# EasyEDA Pro project 运动目标控制与自动追踪系统_2023-08-13.epro

# Schematic Schematic1
Create Date: 2023-08-12; Page Name: 运动目标控制与自动追踪系统; Project Name: 运动目标控制与自动追踪系统; Schematic Name: Schematic1; Update Date: 2023-08-13; Company: 嘉立创EDA; Page Size: A4; Version: V1.0
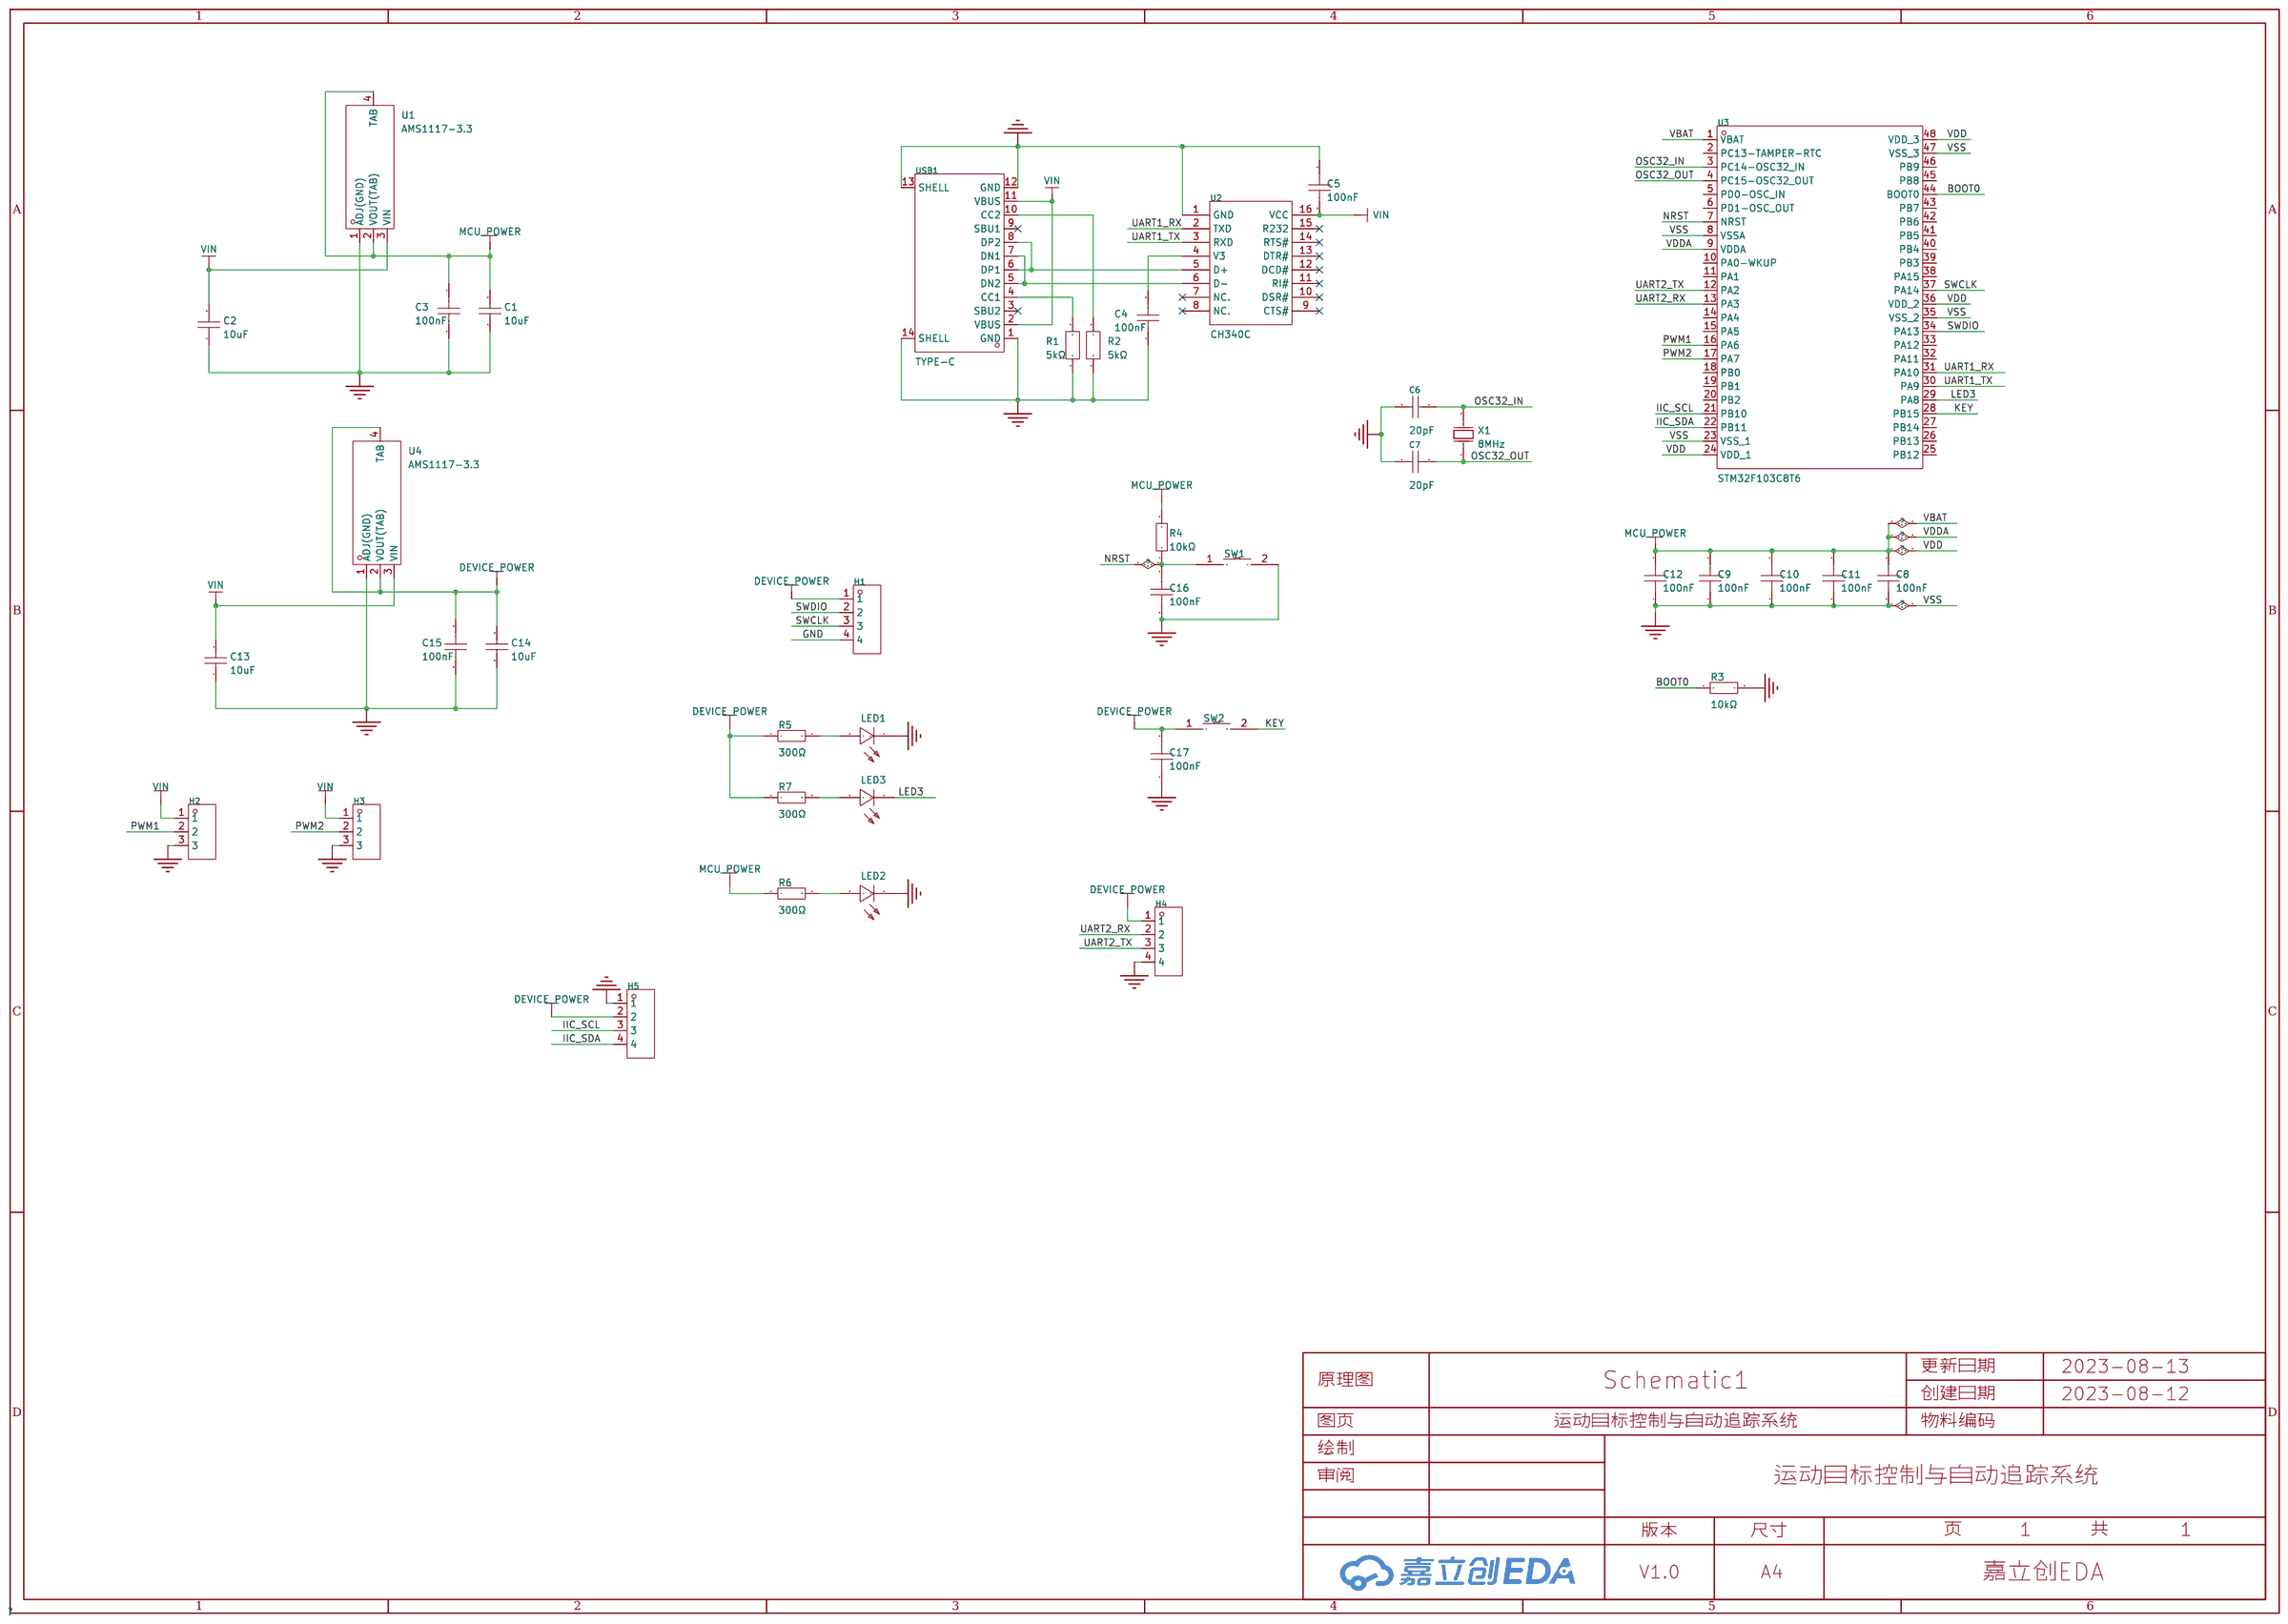
[diagram p0: schematic sheet]

## Parts
C1  10uF  [C0805]
C2  10uF  [C0805]
C3  100nF  [C0603]
C4  100nF  [C0603]
C5  100nF  [C0603]
C6  20pF  [C0402]
C7  20pF  [C0402]
C8  100nF  [C0603]
C9  100nF  [C0603]
C10  100nF  [C0603]
C11  100nF  [C0603]
C12  100nF  [C0603]
C13  10uF  [C0805]
C14  10uF  [C0805]
C15  100nF  [C0603]
C16  100nF  [C0603]
C17  100nF  [C0603]
H1  PZ254R-11-04P  [HDR-TH_4P-P2.54-H-M-W10.4]
H2  PZ254V-11-03P  [HDR-TH_3P-P2.54-V-M]
H3  PZ254V-11-03P  [HDR-TH_3P-P2.54-V-M]
H4  PZ254R-11-04P  [HDR-TH_4P-P2.54-H-M-W10.4]
H5  PM254V-11-04-H85  [HDR-TH_4P-P2.54-V-F]
LED1  NCD0603R1  [LED0603-RD_RED]
LED2  NCD0603R1  [LED0603-RD_RED]
LED3  NCD0603R1  [LED0603-RD_RED]
R1  5kΩ  [R0603]
R2  5kΩ  [R0603]
R3  10kΩ  [R0603]
R4  10kΩ  [R0603]
R5  300Ω  [R0603]
R6  300Ω  [R0603]
R7  300Ω  [R0603]
SW1  TS-1101-C-W  [SW-SMD_L6.0-W3.3-LS8.0]
SW2  TS-1101-C-W  [SW-SMD_L6.0-W3.3-LS8.0]
U1  AMS1117-3.3  [SOT-223-4_L6.5-W3.5-P2.30-LS7.0-BR]
U2  CH340C  [SOP-16_L10.0-W3.9-P1.27-LS6.0-BL]
U3  STM32F103C8T6  [LQFP-48_L7.0-W7.0-P0.50-LS9.0-BL]
U4  AMS1117-3.3  [SOT-223-4_L6.5-W3.5-P2.30-LS7.0-BR]
USB1  TYPE-C  [USB-C-SMD_TYPE-C-6PIN-2MD-073]
X1  8MHz  [OSC-SMD_L5.0-W3.2]

## Library data of the parts
C1 C2 C13 C14 = CL21A106KAYNNNE_C15850: 容值:10uF;精度:±10%;额定电压:25V;材质(温度系数):X5R;; LCSC Part Name: 10uF ±10% 25V; Supplier Part: C15850; Manufacturer: SAMSUNG(三星); Manufacturer Part: CL21A106KAYNNNE; Supplier Footprint: 0805; JLCPCB Part Class: 基础库; Datasheet: https://atta.szlcsc.com/upload/public/pdf/source/20160103/1457707679302.pdf; Supplier: LCSC; Tolerance: ±10%; Voltage Rated: 25V; Temperature Coefficient: X5R
C3-C5 C8-C12 C15-C17 = CL10B104KB8NNNC: 容值:100nF;精度:±10%;额定电压:50V;材质(温度系数):X7R;; LCSC Part Name: 100nF ±10% 50V; Supplier Part: C1591; Manufacturer: SAMSUNG(三星); Supplier Footprint: 0603; JLCPCB Part Class: Extended Part; Datasheet: https://atta.szlcsc.com/upload/public/pdf/source/20160103/1457707680512.pdf; Supplier: LCSC; Tolerance: ±10%; Voltage Rated: 50V; Temperature Coefficient: X7R
C6 C7 = 0402CG200J500NT: 容值:20pF;精度:±5%;额定电压:50V;材质(温度系数):C0G;; LCSC Part Name: 20pF ±5% 50V; Supplier Part: C1554; Manufacturer: FH(风华); Supplier Footprint: 0402; JLCPCB Part Class: 基础库; Datasheet: https://atta.szlcsc.com/upload/public/pdf/source/20200305/C486355_26A10D38EF8C2A5C37091D0039909270.pdf; Supplier: LCSC; Tolerance: ±5%; Voltage Rated: 50V; Temperature Coefficient: C0G
H1 H4 = PZ254R-11-04P: 间距:2.54mm;总PIN位数:4;排数:1;插针结构:1x4P;行距:-;安装类型:弯插;圆针/方针:方针;额定电流:-;额定电压:-;配合针长度:6mm;塑高:2.5mm;触头材质:黄铜;触头镀层:-;工作温度范围:-40℃~+105℃;颜色:黑色;; LCSC Part Name: 2.54mm 1x4P 弯插 方针; Supplier Part: C492412; Manufacturer: XFCN(兴飞); Supplier Footprint: 插件,P=2.54mm; JLCPCB Part Class: 扩展库; Supplier: LCSC; Pitch: 2.54mm; Number of Pins: 4; Number of Rows: 1; Pin Structure: 1x4P; Mounting Type: 弯插; Circluar Pins/Square Pins: 方针; Length of Mating Pin: 6mm; Insulation Height: 2.5mm; Contact Material: 黄铜; Operating Temperature Range: -40℃~+105℃; Color: 黑色
H2 H3 = PZ254V-11-03P: 排数:单排;总PIN位数:3;间距:2.54mm;插针结构:1x3P;行距:-;安装类型:直插;圆针/方针:方针;额定电流:3A;额定电压:250V;配合针长度:6mm;塑高:2.5mm;端接针长度:3mm;工作温度范围:-40℃~+105℃;颜色:黑色;; LCSC Part Name: 2.54mm 1x3P 直插 方针; Supplier Part: C2937625; Manufacturer: XFCN(兴飞); Supplier Footprint: 直插,P=2.54mm; JLCPCB Part Class: 扩展库; Datasheet: 2022-07-12/581362A/62b9d00620994b3696be7eb4af85ad72/双排排针和单排排针.pdf; Supplier: LCSC; Number of Rows: 单排; Number of Pins: 3; Pitch: 2.54mm; Pin Structure: 1x3P; Mounting Type: 直插; Circluar Pins/Square Pins: 方针; Current Rating (Max): 3A; Voltage Rating (Max): 250V; Length of Mating Pin: 6mm; Insulation Height: 2.5mm; Length of End Connection Pin: 3mm; Operating Temperature Range: -40℃~+105℃; Color: 黑色
H5 = PM254V-11-04-H85: 排数:单排;总孔位数:4;间距:2.54mm;插孔结构:1x4P;行距:-;安装类型:直插;塑高:-;触头材质:黄铜;触头镀层:-;; LCSC Part Name: 2.54mm 1x4P; Supplier Part: C541851; Manufacturer: XFCN(兴飞); Supplier Footprint: 直插,P=2.54mm; JLCPCB Part Class: 扩展库; Supplier: LCSC; Number of Rows: 单排; Number of Holes: 4; Pitch: 2.54mm; Holes Structure: 1x4P; Mounting Type: 直插; Contact Material: 黄铜
LED1-LED3 = NCD0603R1_C84263: 发光颜色:红灯;; LCSC Part Name: 红灯; Supplier Part: C84263; Manufacturer: 国星光电; Supplier Footprint: 0603; JLCPCB Part Class: Extended Part; Datasheet: https://atta.szlcsc.com/upload/public/pdf/source/20200820/C84263_DABC6A75E58F576973B407FDBA283D60.pdf; Supplier: LCSC; Emitted Color: 红灯
R1 R2 = AR03BTCX5001: 电阻类型:薄膜电阻;阻值:5kΩ;精度:±0.1%;功率:100mW;; LCSC Part Name: 5kΩ ±0.1% 100mW; Supplier Part: C2828621; Manufacturer: Viking(光颉); Supplier Footprint: 0603; JLCPCB Part Class: 扩展库; Datasheet: https://atta.szlcsc.com/upload/public/pdf/source/20211009/C2828621_7F88408CB1D09DFC08036051E0A6050B.pdf; Supplier: LCSC; Type: 薄膜电阻; Tolerance: ±0.1%; Power(Watts): 100mW; Temperature Coefficient: ±25ppm/℃; Overload Voltage (Max): 50V; Operating Temperature Range: -55℃~+155℃
R3 = RC0603JR-0710KL: 电阻类型:厚膜电阻;阻值:10kΩ;精度:±5%;功率:100mW;; LCSC Part Name: 10kΩ ±5% 100mW; Supplier Part: C99198; Manufacturer: YAGEO(国巨); Supplier Footprint: 0603; JLCPCB Part Class: 扩展库; Datasheet: https://atta.szlcsc.com/upload/public/pdf/source/20181223/C99198_917934A193F41F77D9F7D214A8C79116.pdf; Supplier: LCSC; Type: 厚膜电阻; Tolerance: ±5%; Power(Watts): 100mW; Temperature Coefficient: ±100ppm/℃; Overload Voltage (Max): 75V; Operating Temperature Range: -55℃~+155℃
R4 = RC0603JR-0710KL: 电阻类型:厚膜电阻;阻值:10kΩ;精度:±5%;功率:100mW;; LCSC Part Name: 10kΩ ±5% 100mW; Supplier Part: C99198; Manufacturer: YAGEO(国巨); Supplier Footprint: 0603; JLCPCB Part Class: Extended Part; Datasheet: https://atta.szlcsc.com/upload/public/pdf/source/20181223/C99198_917934A193F41F77D9F7D214A8C79116.pdf; Supplier: LCSC; Type: 厚膜电阻; Tolerance: ±5%; Power(Watts): 100mW; Temperature Coefficient: ±100ppm/℃; Overload Voltage (Max): 75V; Operating Temperature Range: -55℃~+155℃
R5-R7 = 0603WAF3000T5E: 电阻类型:厚膜电阻;阻值:300Ω;精度:±1%;功率:100mW;; LCSC Part Name: 300Ω ±1% 100mW; Supplier Part: C23025; Manufacturer: UNI-ROYAL(厚声); Supplier Footprint: 0603; JLCPCB Part Class: 基础库; Datasheet: https://atta.szlcsc.com/upload/public/pdf/source/20200306/C422600_1E6D84923E4A46A82E41ADD87F860B5C.pdf; Supplier: LCSC; Type: 厚膜电阻; Tolerance: ±1%; Power(Watts): 100mW; Temperature Coefficient: ±100ppm/℃; Overload Voltage (Max): 75V; Operating Temperature Range: -55℃~+155℃
SW1 = TS-1101-C-W: 触点电流:50mA;额定电压(AC):-;额定电压(DC):12V;额定功率:-;绝缘电阻:-;电路结构:单刀单掷;安装方式:立贴;带灯:无;作用力:260gf;机械寿命:5万次;带支架:否;; LCSC Part Name: 立贴 6*3.6*2.5mm 轻触开关 一型3*6*2.5有白ZD b拉伸白色带淡绿按键 卷装; Supplier Part: C318938; Manufacturer: XKB Connectivity(中国星坤); Supplier Footprint: SMD; JLCPCB Part Class: 扩展库; Datasheet: https://atta.szlcsc.com/upload/public/pdf/source/20200227/C318938_C2E53B1EEDE37D980A33616AC086DE53.pdf; Supplier: LCSC; Contact Current: 50mA; Voltage Rating (DC): 12V; Circuit: 单刀单掷; Mounting Style: 立贴; Actuator Style: 矩形按钮; Actuator/Cap Color: 白色带淡绿; With Lamp: 无; Operating Force: 260gf; Mechanical Life: 5万次; Operating Temperature: -30℃~+85℃; Switch Length: 6mm; Switch Width: 3.6mm; Switch Height: 2.5mm; Strike Gundam: 否
SW2 = TS-1101-C-W: 触点电流:50mA;额定电压(AC):-;额定电压(DC):12V;额定功率:-;绝缘电阻:-;电路结构:单刀单掷;安装方式:立贴;带灯:无;作用力:260gf;机械寿命:5万次;带支架:否;; LCSC Part Name: 立贴 6*3.6*2.5mm 轻触开关 一型3*6*2.5有白ZD b拉伸白色带淡绿按键 卷装; Supplier Part: C318938; Manufacturer: XKB Connectivity(中国星坤); Supplier Footprint: SMD; JLCPCB Part Class: Extended Part; Datasheet: https://atta.szlcsc.com/upload/public/pdf/source/20200227/C318938_C2E53B1EEDE37D980A33616AC086DE53.pdf; Supplier: LCSC; Contact Current: 50mA; Voltage Rating (DC): 12V; Circuit: 单刀单掷; Mounting Style: 立贴; Actuator Style: 矩形按钮; Actuator/Cap Color: 白色带淡绿; With Lamp: 无; Operating Force: 260gf; Mechanical Life: 5万次; Operating Temperature: -30℃~+85℃; Switch Length: 6mm; Switch Width: 3.6mm; Switch Height: 2.5mm; Strike Gundam: 否
U1 U4 = AMS1117-3.3 SOT-223: 输出类型:固定;输出极性:正;最大输入电压:18V;输出电压:3.3V;输出电流:1A;电源纹波抑制比(PSRR):60dB@(120Hz);; Supplier Part: C347222; Manufacturer: UMW(广东友台半导体); Supplier Footprint: SOT-223; JLCPCB Part Class: Extended Part; Datasheet: https://atta.szlcsc.com/upload/public/pdf/source/20211011/50CC665C22E3A66C08379A4A74BDA25C.pdf; Supplier: LCSC; Output Type: 固定; Output Polarity: 正; Number of Outputs: 1; Maximum Input Voltage: 18V; Output Voltage: 3.3V; Dropout Voltage: 1.3V@(1A); Output Current: 1A; Power Supply Rejection Ratio (PSRR): 60dB@(120Hz)
U2 = CH340C: 应用功能:收发器;接口协议:USB 2.0;数据速率:2Mbps;; LCSC Part Name: CH340C USB转串口芯片 CH340; Supplier Part: C84681; Manufacturer: WCH(南京沁恒); Supplier Footprint: SOP-16; JLCPCB Part Class: Extended Part; Datasheet: https://atta.szlcsc.com/upload/public/pdf/source/20200819/C84681_ADBED554CE321879DBD6B1D06488689C.pdf; Supplier: LCSC; Applications Function: 收发器; Protocol: USB 2.0; Data Rate: 2Mbps; Supply Voltage: 3.3V；5V
U3 = STM32F103C8T6: CPU内核:ARM Cortex-M3;CPU最大主频:72MHz;工作电压范围:2V~3.6V;内部振荡器:有;程序 FLASH容量:64K@x8bit;RAM总容量:20KB;EEPROM/数据 FLASH容量:-;GPIO端口数量:37;ADC(单元数/通道数/位数):1@x10ch/12bit;外设/功能/协议栈:看门狗；DMA；看门狗；片载温度传感器;工作温度范围:-40℃~+85℃;; LCSC Part Name: ARM Cortex-M3 72MHz 闪存：64K@x8bit RAM：20KB MSL=3; Supplier Part: C8734; Manufacturer: ST(意法半导体); Supplier Footprint: LQFP-48(7x7); JLCPCB Part Class: Basic Part; Supplier: LCSC; CPU Core: ARM Cortex-M3; Maximum Frequency: 72MHz; Supply Voltage Range: 2V~3.6V; Internal Oscillator: 有; Program FLASH Size: 64K@x8bit; RAM Size: 20KB; GPIO Ports Number: 37; ADC (Units/Channels/bits): 1@x10ch/12bit; Peripherals / Functions / Protocol Stacks: 看门狗；DMA；看门狗；片载温度传感器; Operating Temperature Range: -40℃~+85℃
USB1 = TYPE-C 16PIN 2MD(073): 连接器类型:Type-C;标准:-;公母:母座;触点数量:16;端口数量:1;安装方式:卧贴;额定电流 - 电源:5A;工作温度范围:-25℃~+85℃;; LCSC Part Name: TYPE-C母座 16P 4脚插件带定位柱 不锈钢外壳 2次模顶; Supplier Part: C2765186; Manufacturer: SHOU HAN(首韩); Supplier Footprint: SMD; JLCPCB Part Class: Extended Part; Supplier: LCSC; Connector Type: Type-C; Gender: 母座; Number of Contacts: 16; Number of Ports: 1; Mounting Style: 卧贴; Current Rating - Power (Max): 5A; Operating Temperature Range: -25℃~+85℃
X1 = TAXM8M2QLFCDT1T: 频率:8MHz;频率公差:±30ppm;负载电容:20pF;; LCSC Part Name: 8MHz ±30ppm 20pF; Supplier Part: C122522; Manufacturer: TAE(雅晶鑫); Supplier Footprint: SMD5032-2P; JLCPCB Part Class: 扩展库; Datasheet: https://atta.szlcsc.com/upload/public/pdf/source/20220113/59EE8A0E7B9F67FF1BF3C454890DE4E5.pdf; Supplier: LCSC; Crystal Type: 贴片无源晶振; Frequency Tolerance: ±30ppm; Frequency Stability: ±20ppm; Load Capacitance: 20pF; Equivalent Series Resistance (ESR): 80Ω; Operating Temperature: -40℃~+85℃

## Nets
GND: C1.1 C2.1 C3.2 C4.1 C5.1 C6.1 C7.1 C8.1 C9.1 C10.1 C11.1 C12.1 C13.1 C14.1 C15.2 C16.1 C17.1 H1.4 H2.3 H3.3 H4.4 H5.1 LED1.1(K) LED2.1(K) R1.1 R2.1 R3.2 SW1.2 U1.1(ADJ(GND)) U2.1(GND) U3.8(VSSA) U3.23(VSS_1) U3.35(VSS_2) U3.47(VSS_3) U4.1(ADJ(GND)) USB1.1(GND) USB1.12(GND) USB1.13(SHELL) USB1.14(SHELL)
VIN: C2.2 C5.2 C13.2 H2.1 H3.1 U1.3(VIN) U2.16(VCC) U4.3(VIN) USB1.2(VBUS) USB1.11(VBUS)
BOOT0: R3.1 U3.44(BOOT0)
DEVICE_POWER: C14.2 C15.1 C17.2 H1.1 H4.1 H5.2 R5.1 R7.1 SW2.1 U4.2(VOUT(TAB)) U4.4(TAB)
IIC_SCL: H5.3 U3.21(PB10)
IIC_SDA: H5.4 U3.22(PB11)
KEY: SW2.2 U3.28(PB15)
LED3: LED3.1(K) U3.29(PA8)
MCU_POWER: C1.2 C3.1 C8.2 C9.2 C10.2 C11.2 C12.2 R4.2 R6.1 U1.2(VOUT(TAB)) U1.4(TAB) U3.1(VBAT) U3.9(VDDA) U3.24(VDD_1) U3.36(VDD_2) U3.48(VDD_3)
NRST: C16.2 R4.1 SW1.1 U3.7(NRST)
OSC32_IN: C6.2 U3.3(PC14-OSC32_IN) X1.2(OSC2)
OSC32_OUT: C7.2 U3.4(PC15-OSC32_OUT) X1.1(OSC1)
PWM1: H2.2 U3.16(PA6)
PWM2: H3.2 U3.17(PA7)
SWCLK: H1.3 U3.37(PA14)
SWDIO: H1.2 U3.34(PA13)
UART1_RX: U2.2(TXD) U3.31(PA10)
UART1_TX: U2.3(RXD) U3.30(PA9)
UART2_RX: H4.2 U3.13(PA3)
UART2_TX: H4.3 U3.12(PA2)
$1N1310: U2.6(D-) USB1.5(DN2) USB1.7(DN1)
$1N1322: U2.5(D+) USB1.6(DP1) USB1.8(DP2)
$1N1391: C4.2 U2.4(V3)
$1N1533: R1.2 USB1.4(CC1)
$1N1548: R2.2 USB1.10(CC2)
$1N3090: LED1.2(A) R5.2
$1N3303: LED2.2(A) R6.2
$1N9814: LED3.2(A) R7.2

Not connected (* = marked no-connect by the designer): U2 7(NC.)* 8(NC.)* 9(CTS#)* 10(DSR#)* 11(RI#)* 12(DCD#)* 13(DTR#)* 14(RTS#)* 15(R232)*; U3 2(PC13-TAMPER-RTC) 5(PD0-OSC_IN) 6(PD1-OSC_OUT) 10(PA0-WKUP) 11(PA1) 14(PA4) 15(PA5) 18(PB0) 19(PB1) 20(PB2) 25(PB12) 26(PB13) 27(PB14) 32(PA11) 33(PA12) 38(PA15) 39(PB3) 40(PB4) 41(PB5) 42(PB6) 43(PB7) 45(PB8) 46(PB9); USB1 3(SBU2)* 9(SBU1)*

# Board 运动目标控制与自动追踪系统
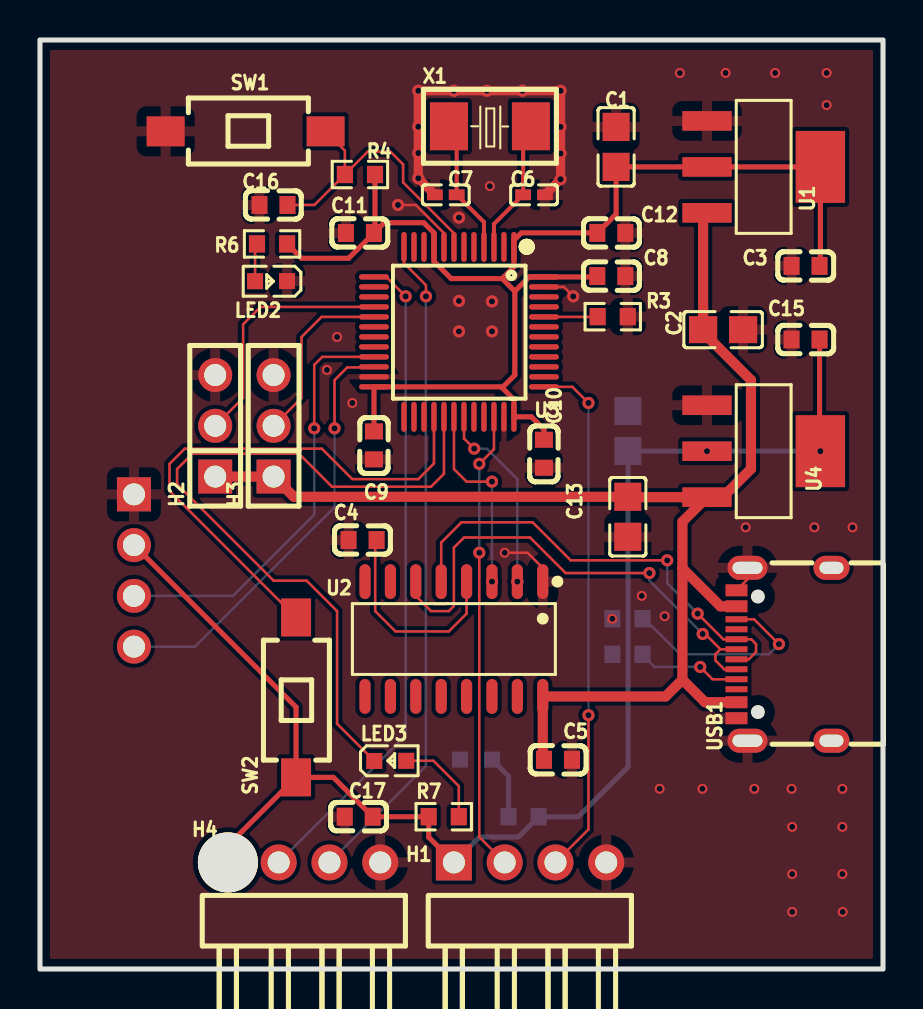
[diagram p1: board, top side]
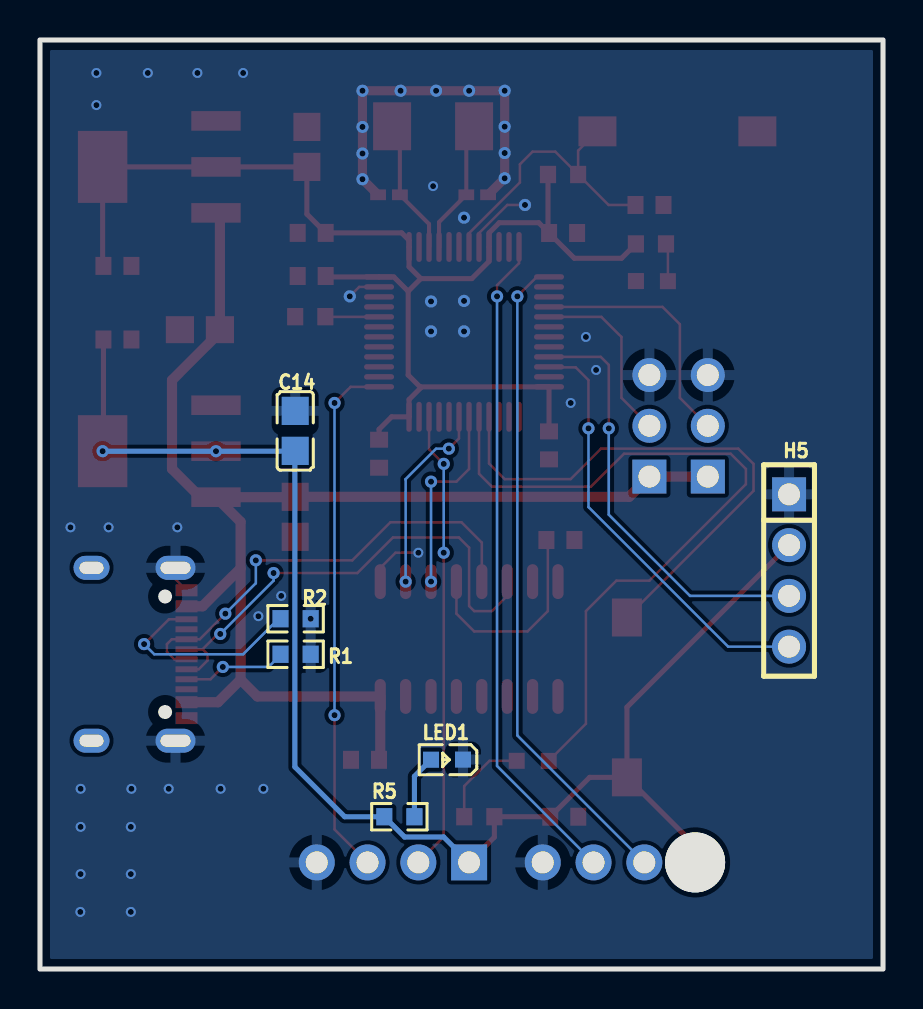
[diagram p2: board, bottom side, seen from below]

Outline 42.16 x 46.48 mm; copper layers: Top Layer, Bottom Layer. Coordinates in mm from the lower left corner of the outline.
Outline path: rectangle 0,46.48 42.16,0
Stack: Top Layer 0.035mm / Dielectric1 1.51mm FR4 er 4.5 / Bottom Layer 0.035mm

## Design rules (mm)
net OSC32_IN: DP1
net OSC32_OUT: DP1
template: JLCPCB Capability(Two Layers Board)
spacing copperThickness1oz (default): track to track 0.102, other pairs 0.152 to 0.3
spacing copperThickness2oz: track to track 0.203, other pairs 0.152 to 0.3
track width copperThickness1oz (default): min 0.127, default 0.254, max 2.54
track width copperThickness2oz: min 0.203, default 0.254, max 2.54
differential pair differentialPair (default): width min 0.127, default 0.254, max 2.54; gap min 0.152, default 0.152
via viaSize (default): diameter min 0.5, default 0.61, max 10; hole min 0.3, default 0.305, max 6.3

## Placement (name value [footprint] x y rotation side)
C1  10uF  [C0805]  28.81 41.13 270 top
C2  10uF  [C0805]  34.17 31.99 180 top
C3  100nF  [C0603]  38.29 35.18 180 top
C4  100nF  [C0603]  16.14 21.46 0 top
C5  100nF  [C0603]  25.91 10.47 180 top
C6  20pF  [C0402]  24.71 38.74 180 top
C7  20pF  [C0402]  20.3 38.74 0 top
C8  100nF  [C0603]  28.57 34.67 180 top
C9  100nF  [C0603]  16.7 26.2 90 top
C10  100nF  [C0603]  25.2 25.78 90 top
C11  100nF  [C0603]  16 36.82 0 top
C12  100nF  [C0603]  28.57 36.83 180 top
C13  10uF  [C0805]  29.4 22.63 90 top
C14  10uF  [C0805]  29.4 26.92 270 bottom
C15  100nF  [C0603]  38.29 31.5 180 top
C16  100nF  [C0603]  11.68 38.23 0 top
C17  100nF  [C0603]  15.94 7.62 0 top
H1  PZ254R-11-04P  [HDR-TH_4P-P2.54-H-M-W10.4]  24.51 5.33 0 top
H2  PZ254V-11-03P  [HDR-TH_3P-P2.54-V-M]  8.76 27.18 90 top
H3  PZ254V-11-03P  [HDR-TH_3P-P2.54-V-M]  11.68 27.18 90 top
H4  PZ254R-11-04P  [hdr-th_4p-p2.54-h-m-w10.4]  13.21 5.33 0 top
H5  PM254V-11-04-H85  [HDR-TH_4P-P2.54-V-F]  4.7 19.94 270 bottom
LED1  NCD0603R1  [LED0603-RD_RED]  21.81 10.48 0 bottom
LED2  NCD0603R1  [LED0603-RD_RED]  11.56 34.42 180 top
LED3  NCD0603R1  [LED0603-RD_RED]  17.52 10.41 0 top
R1  5kΩ  [R0603]  29.38 15.75 0 bottom
R2  5kΩ  [R0603]  29.38 17.53 0 bottom
R3  10kΩ  [R0603]  28.65 32.64 0 top
R4  10kΩ  [R0603]  16 39.75 0 top
R5  300Ω  [R0603]  24.19 7.62 180 bottom
R6  300Ω  [R0603]  11.61 36.28 180 top
R7  300Ω  [R0603]  20.19 7.62 0 top
SW1  TS-1101-C-W  [SW-SMD_L6.0-W3.3-LS8.0]  10.28 41.91 180 top
SW2  TS-1101-C-W  [SW-SMD_L6.0-W3.3-LS8.0]  12.81 13.59 90 top
U1  AMS1117-3.3  [SOT-223-4_L6.5-W3.5-P2.30-LS7.0-BR]  36.2 40.13 180 top
U2  CH340C  [SOP-16_L10.0-W3.9-P1.27-LS6.0-BL]  20.7 16.51 180 top
U3  STM32F103C8T6  [LQFP-48_L7.0-W7.0-P0.50-LS9.0-BL]  20.95 31.88 180 top
U4  AMS1117-3.3  [SOT-223-4_L6.5-W3.5-P2.30-LS7.0-BR]  36.2 25.91 180 top
USB1  TYPE-C  [USB-C-SMD_TYPE-C-6PIN-2MD-073]  37.21 15.75 90 top
X1  8MHz  [OSC-SMD_L5.0-W3.2]  22.5 42.16 0 top

## Footprints (pads in the part's own frame, mm; a bottom-side part is the same pattern mirrored in y, then rotated)
C0402
  rect 0.79x0.54 smd: 1(-0.545,0) 2(0.545,0)
C0603
  rect 0.8x0.9 smd: 1(-0.7,0) 2(0.7,0)
C0805
  rect 1.41x1.35 smd: 1(-1,0) 2(1,0)
HDR-TH_3P-P2.54-V-M
  rect 1.7x1.7 hole 1.1: 1(-2.54,0)
  round 1.7 hole 1.1: 2(0,0) 3(2.54,0)
hdr-th_4p-p2.54-h-m-w10.4
  round 3 hole 3: 1(-3.81,0)
  round 1.8 hole 1.1: 2(-1.27,0) 3(1.27,0) 4(3.81,0)
HDR-TH_4P-P2.54-H-M-W10.4
  rect 1.8x1.8 hole 1.1: 1(-3.81,0)
  round 1.8 hole 1.1: 2(-1.27,0) 3(1.27,0) 4(3.81,0)
HDR-TH_4P-P2.54-V-F
  rect 1.7x1.7 hole 1.1: 1(-3.81,0)
  round 1.7 hole 1.1: 2(-1.27,0) 3(1.27,0) 4(3.81,0)
LED0603-RD_RED
  rect 0.8x0.8 smd: 1(-0.799,-0.004) 2(0.799,0.004)
LQFP-48_L7.0-W7.0-P0.50-LS9.0-BL
  oval 0.27x1.5 smd: 1(-2.75,-4.25) 2(-2.25,-4.25) 3(-1.75,-4.25) 4(-1.25,-4.25) 5(-0.75,-4.25) 6(-0.25,-4.25) 7(0.25,-4.25) 8(0.75,-4.25) 9(1.25,-4.25) 10(1.75,-4.25) 11(2.25,-4.25) 12(2.75,-4.25) 25(2.75,4.25) 26(2.25,4.25) 27(1.75,4.25) 28(1.25,4.25) 29(0.75,4.25) 30(0.25,4.25) 31(-0.25,4.25) 32(-0.75,4.25) 33(-1.25,4.25) 34(-1.75,4.25) 35(-2.25,4.25) 36(-2.75,4.25)
  oval 1.5x0.27 smd: 13(4.25,-2.75) 14(4.25,-2.25) 15(4.25,-1.75) 16(4.25,-1.25) 17(4.25,-0.75) 18(4.25,-0.25) 19(4.25,0.25) 20(4.25,0.75) 21(4.25,1.25) 22(4.25,1.75) 23(4.25,2.25) 24(4.25,2.75) 37(-4.25,2.75) 38(-4.25,2.25) 39(-4.25,1.75) 40(-4.25,1.25) 41(-4.25,0.75) 42(-4.25,0.25) 43(-4.25,-0.25) 44(-4.25,-0.75) 45(-4.25,-1.25) 46(-4.25,-1.75) 47(-4.25,-2.25) 48(-4.25,-2.75)
OSC-SMD_L5.0-W3.2
  rect 1.9x2.4 smd: 1(-2.05,0) 2(2.05,0)
R0603
  rect 0.806x0.864 smd: 1(-0.753,0) 2(0.753,0)
SOP-16_L10.0-W3.9-P1.27-LS6.0-BL
  oval 0.56x1.745 smd: 1(-4.445,-2.873) 2(-3.175,-2.873) 3(-1.905,-2.873) 4(-0.635,-2.873) 5(0.635,-2.873) 6(1.905,-2.873) 7(3.175,-2.873) 8(4.445,-2.873) 9(4.445,2.873) 10(3.175,2.873) 11(1.905,2.873) 12(0.635,2.873) 13(-0.635,2.873) 14(-1.905,2.873) 15(-3.175,2.873) 16(-4.445,2.873)
SOT-223-4_L6.5-W3.5-P2.30-LS7.0-BR
  rect 2.47x0.98 smd: 1(2.835,-2.3) 2(2.835,0) 3(2.835,2.3)
  rect 2.47x3.6 smd: 4(-2.835,0)
SW-SMD_L6.0-W3.3-LS8.0
  rect 1.9x1.5 smd: 1(-4,0) 2(4,0)
USB-C-SMD_TYPE-C-6PIN-2MD-073
  rect 0.6x1.1 smd: 1(-3.2,2.375) 2(-2.4,2.375) 11(2.4,2.375) 12(3.2,2.375)
  rect 0.3x1.1 smd: 3(-1.75,2.375) 4(-1.25,2.375) 5(-0.75,2.375) 6(-0.25,2.375) 7(0.25,2.375) 8(0.75,2.375) 9(1.25,2.375) 10(1.75,2.375)
  oval 1.2x2 hole 0.6x1.5: 13(-4.325,1.825) 14(4.325,1.825)
  oval 1.2x1.8 hole 0.6x1.2: 13(-4.325,-2.375) 14(4.325,-2.375)

## Nets
As in the schematic.

Pads without a net: U2 7 8 9 10 11 12 13 14 15; U3 2 5 6 10 11 14 15 18 19 20 25 26 27 32 33 38 39 40 41 42 43 45 46; USB1 3 9

## Via types
v1: diameter 0.61, hole 0.305, Top Layer to Bottom Layer, 38 vias
v2: diameter 0.5, hole 0.3, Top Layer to Bottom Layer, 27 vias

## Routing (per net, layer and track width the routed paths; a pad name or vN(x,y) marks a point on that pad's centre or on a via; arc(x,y) is an arc through that point)
GND: length 27.7
  Top Layer w0.127: v1(17.91,38.23) 18.8,38.23 20.2,36.82 U3.8 ; v2(23.24,20.83) 24.38,20.83 25.15,20.07 U2.1 ; USB1.14 35.39,19.5 USB1.12 ; U3.47 26.2,34.13 v1(26.67,33.66)
  Top Layer w0.457: C6.1 v1(26.03,39.52) v1(26.03,40.8) v1(26.03,42.13) v1(26.03,43.94) v1(24.13,43.94) v1(22.35,43.94) v1(20.7,43.94) v1(18.92,43.94) v1(18.92,42.14) v1(18.92,40.83) v1(18.92,39.56) C7.1
  vias: v1(20.95,37.59) v1(20.95,33.43) v1(20.95,31.9) v1(22.61,33.4) v1(22.61,31.9) v2(14.35,29.97) v2(14.86,31.62) v2(15.62,28.32) v2(22.5,39.17) v2(28.63,17.53) v2(30.1,18.67) v2(30.99,9.02) v2(31.24,17.65) v2(32,44.83) v2(33.13,9.02) v2(34.29,44.83) v2(35.29,22.1) v2(35.73,9.02) v2(36.77,44.83) v2(37.59,9.02) v2(37.62,7.11) v2(37.62,4.75) v2(37.62,2.86) v2(38.73,22.1) v2(39.34,44.83) v2(39.34,43.22) v2(40.13,9.02) v2(40.13,7.11) v2(40.13,4.75) v2(40.15,2.86) v2(40.64,22.1)
VIN: length 68.5
  Top Layer w0.508: 32.13,20.05 34.03,18.15 USB1.11 ; 32.13,20.05 32.13,14.48 ; 32.13,20.05 32.13,22.38 U4.3 ; 32.13,14.48 33.26,13.35 USB1.2 ; 32.13,14.48 31.29,13.64 U2.16 25.15,10.53 C5.2 ; U1.3 33.17,37.64 C2.2 33.17,31.86 35.56,29.46 35.56,25.02 34.15,23.61 U4.3 ; U4.3 29.42,23.61 C13.2 12.7,23.63 H3.1 H2.1
BOOT0: length 2.7
  Top Layer w0.127: U3.44 27.88,32.63 R3.1
DEVICE_POWER: length 72.6
  Top Layer w0.254: C15.1 38.99,25.95 v1(39.03,25.91) ; SW2.1 12.81,13.1 H5.2 ; SW2.1 14.67,9.59 C17.2 R7.1 19.44,6.6 H1.1 ; SW2.1 9.4,6.18 H4.1
  Bottom Layer w0.254: 29.42,25.91 C14.2 ; 29.42,25.91 v1(33.36,25.91) v1(39.03,25.91) ; 29.42,25.91 29.42,10.11 26.92,7.62 R5.1 23.93,6.6 21.97,6.6 H1.1
IIC_SCL: length 21.3
  Top Layer w0.127: U3.21 14.12,30.63 13.72,30.23 v1(13.72,27.05)
  Bottom Layer w0.127: v1(13.72,27.05) 13.72,22.73 9.65,18.67 H5.3
IIC_SDA: length 21.5
  Top Layer w0.127: U3.22 16.68,30.1 15.37,30.1 14.73,29.46 v1(14.73,27.05)
  Bottom Layer w0.127: H5.4 7.75,16.13 14.73,23.11 v1(14.73,27.05)
KEY: length 27.1
  Top Layer w0.127: U3.28 19.7,25.29 18.92,24.51 15.62,24.51 14.1,26.04 7.24,26.04 6.48,25.27 6.48,23.92 SW2.2
LED3: length 37.1
  Top Layer w0.127: LED3.1 14.86,12.27 14.86,17.91 13.33,19.43 11.68,19.43 6.86,24.26 6.86,25.02 7.62,25.78 12.95,25.78 14.6,24.13 19.56,24.13 20.2,24.78 U3.29
MCU_POWER: length 65.1
  Top Layer w0.254: C3.1 39.03,35.22 U1.4 U1.2 C1.2 28.81,37.77 C12.2 24.07,36.83 23.7,36.46 U3.1 23.7,35.14 23.11,34.54 ; 16.76,36.88 C11.2 15.44,35.56 13.08,35.56 R6.1 ; 16.76,36.88 R4.2 ; 16.76,36.88 17.22,37.34 19.19,37.34 19.7,36.83 U3.9 19.7,35.4 20.57,34.54 23.11,34.54 ; C10.2 25.2,27 24.58,27.63 U3.36 23.7,28.49 23.11,29.08 23.13,29.1 ; 23.13,29.1 23.13,29.13 U3.24 C9.2 ; 23.13,29.1 23.75,29.72 23.75,33.91 ; 23.11,34.54 23.75,33.91 ; 23.75,33.91 24.47,34.63 U3.48 27.83,34.63 C8.2
NRST: length 14.9
  Top Layer w0.127: SW1.1 15.25,40.95 R4.1 ; C16.2 13.72,38.23 R4.1 ; R4.1 16.39,40.89 17.53,40.89 18.16,40.26 18.16,39.35 20.7,36.81 U3.7
OSC32_IN: length 6.8
  Top Layer w0.203: X1.2 24.16,41.78 C6.2 22.7,37.28 U3.3
OSC32_OUT: length 6.8
  Top Layer w0.203: X1.1 20.84,41.78 C7.2 22.2,37.37 22.2,36.09
PWM1: length 12.6
  Top Layer w0.127: U3.16 11.03,33.13 10.16,32.26 10.16,28.58 H2.2
PWM2: length 9.1
  Top Layer w0.127: U3.17 14.08,32.63 13.08,31.62 13.08,28.58 H3.2
SWCLK: length 26.2
  Top Layer w0.127: v1(27.43,12.7) 27.43,6.99 H1.3 ; v1(27.43,28.32) 26.63,29.13 U3.37
  Bottom Layer w0.127: v1(27.43,28.32) v1(27.43,12.7)
SWDIO: length 23.1
  Top Layer w0.127: v1(21.97,20.83) 21.97,6.6 H1.2 ; v1(21.97,25.27) 22.7,26.01 U3.34
  Bottom Layer w0.127: v1(21.97,20.83) v1(21.97,25.27)
UART1_RX: length 9.7
  Top Layer w0.127: v1(21.72,26.04) 21.21,26.54 21.21,27.62 U3.31
  Bottom Layer w0.127: v1(21.72,26.04) 22.35,26.04 23.88,24.51 v1(23.88,19.38)
UART1_TX: length 9.8
  Top Layer w0.127: U3.30 20.7,25.02 21.34,24.38 v1(22.61,24.38)
  Bottom Layer w0.127: v1(22.61,19.38) v1(22.61,24.38)
UART2_RX: length 32.9
  Top Layer w0.127: v1(18.29,33.66) 17.32,34.63 U3.13
  Bottom Layer w0.127: v1(18.29,33.66) 18.29,11.68 H4.2
UART2_TX: length 33.2
  Top Layer w0.127: v1(19.3,33.66) 19.3,34.21 18.2,35.31 U3.12
  Bottom Layer w0.127: v1(19.3,33.66) 19.3,10.16 14.48,5.33
$1N1310: length 24.7
  Top Layer w0.127: 34.03,16 33.78,15.75 33.78,15.44 34.22,15 USB1.5 ; 34.03,16 33.27,16.76 v1(33.15,16.76) ; 34.03,16 USB1.7 ; v1(30.48,19.81) 26.29,19.81 24.51,21.59 21.21,21.59 20.7,21.08 20.7,18.16 20.45,17.91 19.56,17.91 18.8,18.67 U2.6
  Bottom Layer w0.127: v1(33.15,16.76) 30.48,19.43 v1(30.48,19.81)
$1N1322: length 22.8
  Top Layer w0.127: v1(32.89,17.78) 34.17,16.5 USB1.8 35.57,16.5 35.81,16.26 35.81,15.86 35.45,15.5 USB1.6 ; U2.5 20.07,21.34 21.08,22.35 24.64,22.35 26.54,20.45 v1(31.37,20.45)
  Bottom Layer w0.127: v1(31.37,20.45) 31.37,19.3 v1(32.89,17.78)
$1N1391: length 10.5
  Top Layer w0.127: C4.2 16.76,21.39 16.76,17.91 17.78,16.89 20.45,16.89 21.34,17.78 U2.4
$1N1533: length 5.3
  Top Layer w0.127: v1(33.02,15.11) 33.63,14.5 USB1.4
  Bottom Layer w0.127: 30.1,15.75 30.73,15.11 v1(33.02,15.11)
$1N1548: length 10.3
  Top Layer w0.127: USB1.10 35.72,17.5 v1(36.96,16.26)
  Bottom Layer w0.127: v1(36.96,16.26) 36.45,15.75 32,15.75 30.23,17.53
$1N3090: length 3.2
  Bottom Layer w0.254: R5.2 23.44,9.64 LED1.2
$1N3303: length 1.9
  Top Layer w0.127: 10.76,34.41 10.76,36.18 R6.2
$1N9814: length 4.7
  Top Layer w0.127: LED3.2 19.68,10.42 20.95,9.15 R7.2

## Copper pours and planes (outline as drawn; the poured copper is in the pictures)
GND on Top Layer: -2.16,48.9 44.07,48.9 44.07,-2.92 -2.16,-2.92
GND on Bottom Layer: -2.79,49.53 45.21,49.53 45.21,-2.79 -2.79,-2.79
